# EAGLE schematic HeatingController (EAGLE 6.5.0)

## Sheet 1 of 2
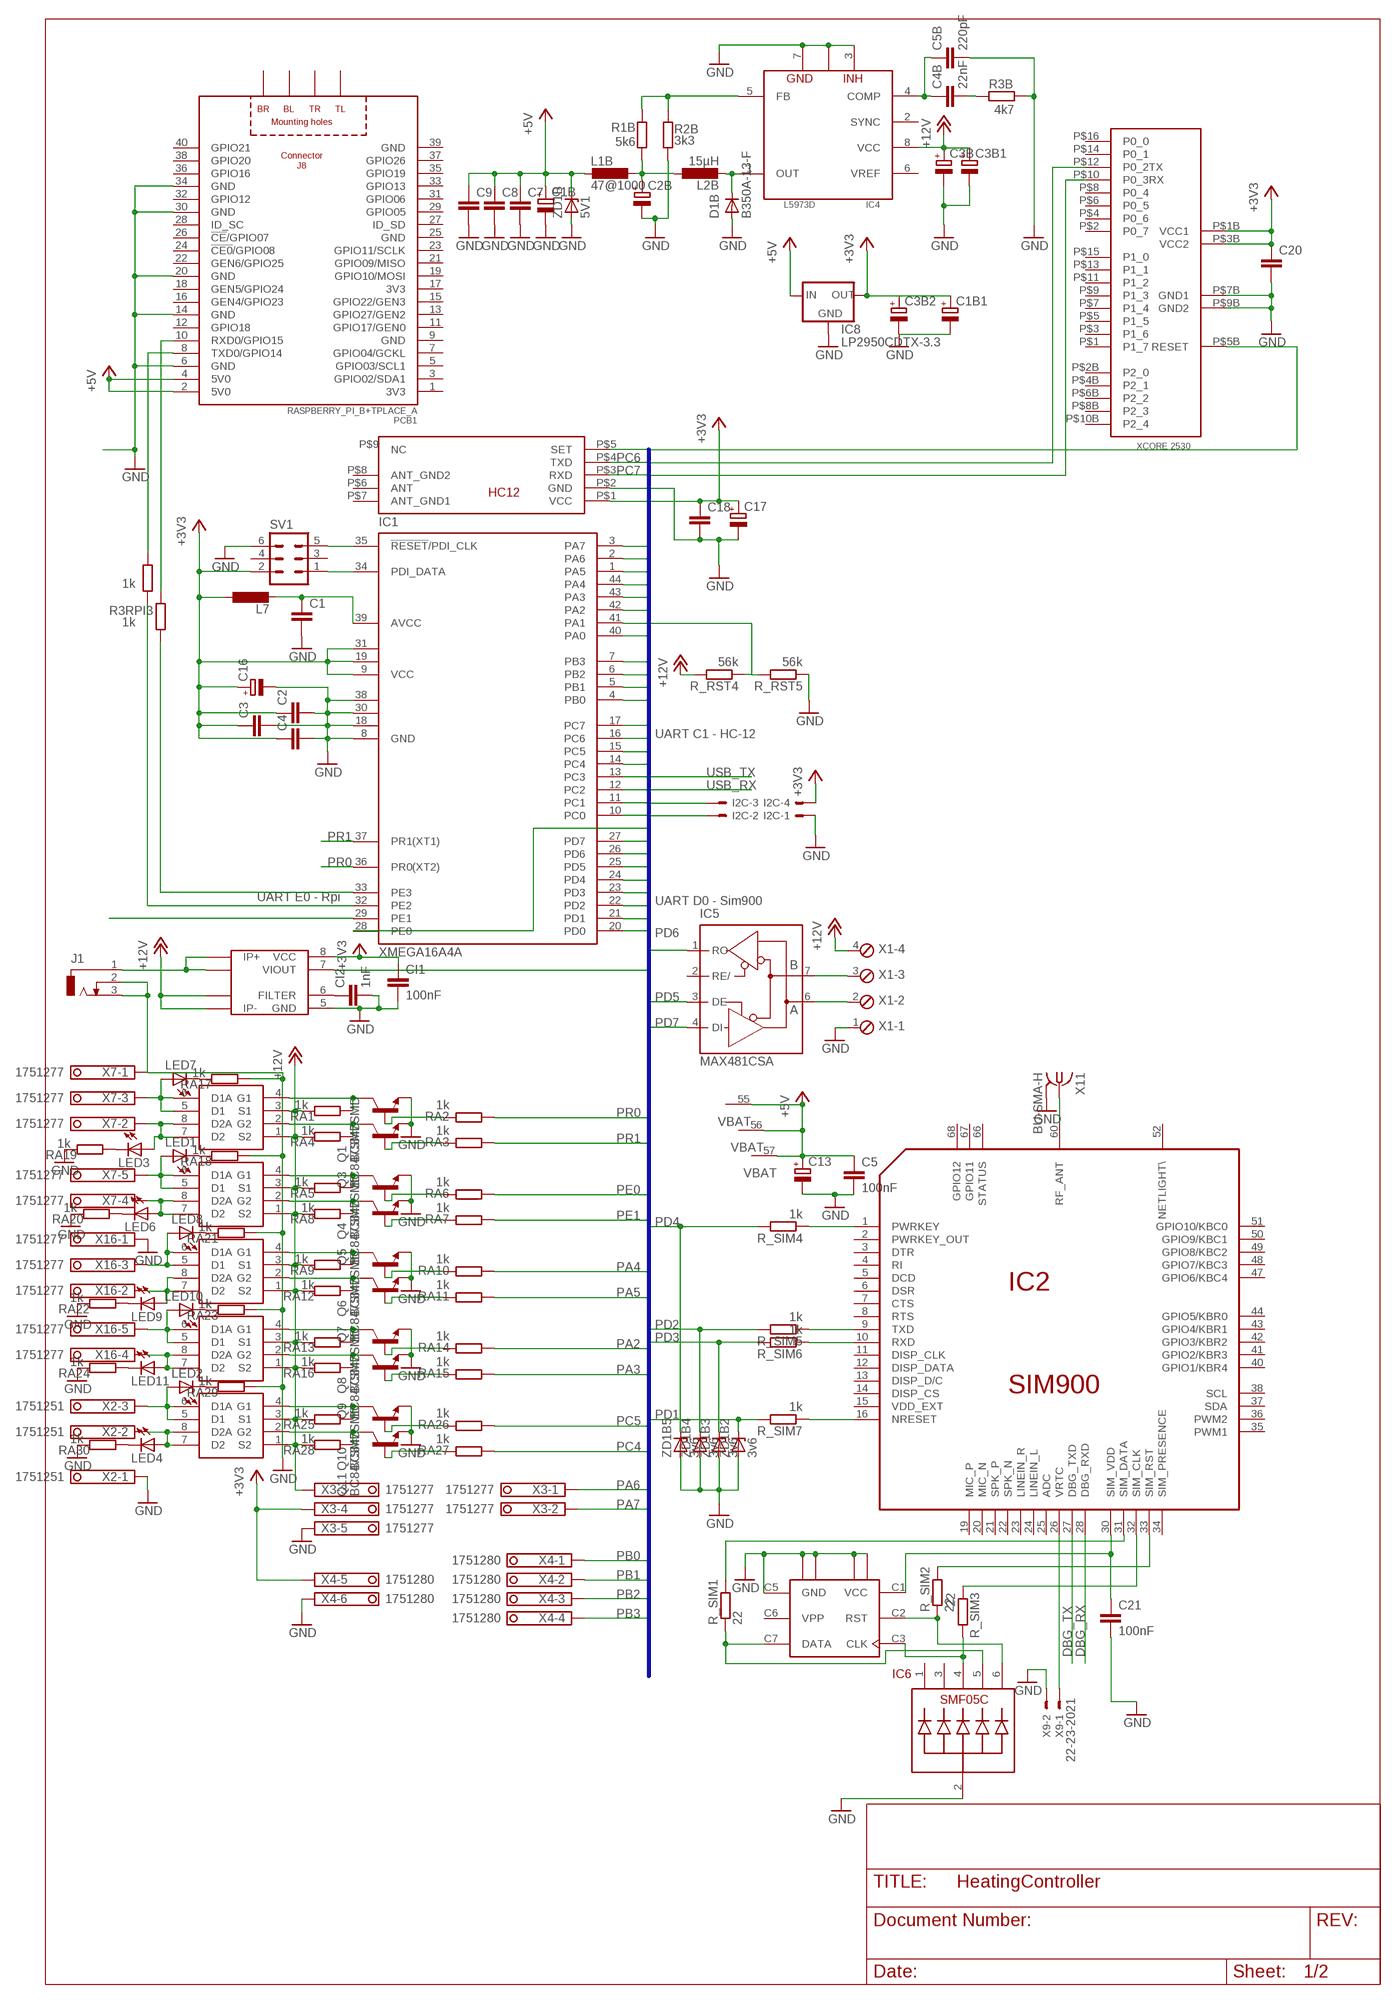
[diagram p0: schematic, sheet 1]

### Parts
C1  C-EUC0805  [C0805]
C1B  CPOL-EU153CLV-0405  [153CLV-0405]
C1B1  CPOL-EU140CLH-0810  [140CLH-0810]
C2  C-EUC0805  [C0805]
C2B  CPOL-EU153CLV-0405  [153CLV-0405]
C3  C-EUC0805  [C0805]
C3B  CPOL-EU153CLV-0405  [153CLV-0405]
C3B1  CPOL-EU153CLV-0605  [153CLV-0605]
C3B2  CPOL-EU150CLZ-0810  [150CLZ-0810]
C4  C-EUC0805  [C0805]
C4B  22nF  C-EUC0805  [C0805]
C5  100nF  C-EUC1206  [C1206]
C5B  220pF  C-EUC0805  [C0805]
C7  C-EUC1206K  [C1206K]
C8  C-EUC1206K  [C1206K]
C9  C-EUC1206K  [C1206K]
C13  CPOL-EU153CLV-0605  [153CLV-0605]
C16  CPOL-EU153CLV-0405  [153CLV-0405]
C17  CPOL-EU140CLH-0810  [140CLH-0810]
C18  C-EUC0805  [C0805]
C20  C-EUC0805  [C0805]
C21  100nF  C-EUC1206  [C1206]
CI1  100nF  C-EUC0805  [C0805]
CI2  1nF  C-EUC0805  [C0805]
D1B  B350A-13-F  GF1  [SMA-DO214AC]
I2C  22-23-2041  [22-23-2041]
IC1  XMEGA16A4A  [TQFP44]
IC2  SIM900  [SIM900]
IC4  L5973D  [HSOP8-PAD]
IC5  MAX481CSA  [SO08]
IC6  SMF05C  [SC-70-6]
IC8  LP2950CDTX-3.3  [DPACK]
J1  DCJ0303  [DCJ0303]
L1B  47@1000  L-EUL4532P  [L4532P]
L2B  15µH  L-EUWE-TPC  [POWER-CHOKE_WE-TPC]
L7  L-EUL4035M  [L4035M]
LED1  LEDCHIPLED_0805  [CHIPLED_0805]
LED2  LEDCHIPLED_0805  [CHIPLED_0805]
LED3  LEDCHIPLED_0805  [CHIPLED_0805]
LED4  LEDCHIPLED_0805  [CHIPLED_0805]
LED6  LEDCHIPLED_0805  [CHIPLED_0805]
LED7  LEDCHIPLED_0805  [CHIPLED_0805]
LED8  LEDCHIPLED_0805  [CHIPLED_0805]
LED9  LEDCHIPLED_0805  [CHIPLED_0805]
LED10  LEDCHIPLED_0805  [CHIPLED_0805]
LED11  LEDCHIPLED_0805  [CHIPLED_0805]
PCB1  RASPBERRY_PI_B+TPLACE_A  [RASPBERRY_PI_APLUS_TPLACE]
Q1  BC847SMD  [SOT23]
Q3  BC847SMD  [SOT23]
Q4  BC847SMD  [SOT23]
Q5  BC847SMD  [SOT23]
Q6  BC847SMD  [SOT23]
Q7  BC847SMD  [SOT23]
Q8  BC847SMD  [SOT23]
Q9  BC847SMD  [SOT23]
Q10  BC847SMD  [SOT23]
Q11  BC847SMD  [SOT23]
R1B  5k6  R-EU_R1206  [R1206]
R2B  3k3  R-EU_R1206  [R1206]
R3B  4k7  R-EU_R1206  [R1206]
R3RPI2  1k  R-EU_R1206  [R1206]
R3RPI3  1k  R-EU_R1206  [R1206]
R_RST4  56k  R-EU_R1206  [R1206]
R_RST5  56k  R-EU_R1206  [R1206]
R_SIM1  22  R-EU_R1206  [R1206]
R_SIM2  22  R-EU_R1206  [R1206]
R_SIM3  22  R-EU_R1206  [R1206]
R_SIM4  1k  R-EU_R1206  [R1206]
R_SIM5  1k  R-EU_R1206  [R1206]
R_SIM6  1k  R-EU_R1206  [R1206]
R_SIM7  1k  R-EU_R1206  [R1206]
RA1  1k  R-EU_R0805  [R0805]
RA2  1k  R-EU_R0805  [R0805]
RA3  1k  R-EU_R0805  [R0805]
RA4  1k  R-EU_R0805  [R0805]
RA5  1k  R-EU_R0805  [R0805]
RA6  1k  R-EU_R0805  [R0805]
RA7  1k  R-EU_R0805  [R0805]
RA8  1k  R-EU_R0805  [R0805]
RA9  1k  R-EU_R0805  [R0805]
RA10  1k  R-EU_R0805  [R0805]
RA11  1k  R-EU_R0805  [R0805]
RA12  1k  R-EU_R0805  [R0805]
RA13  1k  R-EU_R0805  [R0805]
RA14  1k  R-EU_R0805  [R0805]
RA15  1k  R-EU_R0805  [R0805]
RA16  1k  R-EU_R0805  [R0805]
RA17  1k  R-EU_R0805  [R0805]
RA18  1k  R-EU_R0805  [R0805]
RA19  1k  R-EU_R0805  [R0805]
RA20  1k  R-EU_R0805  [R0805]
RA21  1k  R-EU_R0805  [R0805]
RA22  1k  R-EU_R0805  [R0805]
RA23  1k  R-EU_R0805  [R0805]
RA24  1k  R-EU_R0805  [R0805]
RA25  1k  R-EU_R0805  [R0805]
RA26  1k  R-EU_R0805  [R0805]
RA27  1k  R-EU_R0805  [R0805]
RA28  1k  R-EU_R0805  [R0805]
RA29  1k  R-EU_R0805  [R0805]
RA30  1k  R-EU_R0805  [R0805]
SV1  ML6  [ML6]
U$1  AO4801A  [SO-08]
U$2  AO4801A  [SO-08]
U$3  HC-12  [HC-12]
U$4  XCORE2530  [XCORE2530]
U$7  SCU-W0822XR-06115R-BCA0  [115R-BCA0]
U$8  ACS712SO8  [SO-08M]
U$9  AO4801A  [SO-08]
U$10  AO4801A  [SO-08]
U$11  AO4801A  [SO-08]
X1  MPT4  [4POL254]
X2  1751251  [1751251]
X3  1751277  [1751277]
X4  1751280  [1751280]
X7  1751277  [1751277]
X9  22-23-2021  [22-23-2021]
X11  BU-SMA-H  [BU-SMA-H]
X16  1751277  [1751277]
ZD1B  5V1  BZV55-C5V1  [SOD80C]
ZD1B2  3v6  BZV55-C5V1  [SOD80C]
ZD1B3  3v6  BZV55-C5V1  [SOD80C]
ZD1B4  3v6  BZV55-C5V1  [SOD80C]
ZD1B5  3v6  BZV55-C5V1  [SOD80C]

### Nets
+3V3: C1B1.+ C2.1 C3.1 C3B2.+ C4.1 C16.+ C17.+ C18.1 C20.1 CI1.1 I2C.4 IC1.9(VCC) IC1.19(VCC1) IC1.31(VCC2) IC8.3(OUT) L7.1 SV1.2 U$3.P$1(VCC) U$4.P$1B(VCC1) U$4.P$3B(VCC2) U$8.8(VCC) X3.4 X4.5 ; also sheet 2
+5V: C1B.+ C5.1 C7.1 C8.1 C9.1 C13.+ IC2.55(VBAT) IC2.56(VBAT) IC2.57(VBAT) IC8.1(IN) L1B.2 PCB1.2(5V0) PCB1.4(5V0) ZD1B.C ; also sheet 2
+12V: C3B1.+ C3B.+ IC4.8(VCC) R_RST4.2 RA1.2 RA4.2 RA5.2 RA8.2 RA9.2 RA12.2 RA13.2 RA16.2 RA25.2 RA28.2 U$1.1(S2) U$1.3(S1) U$2.1(S2) U$2.3(S1) U$8.3(IP-3) U$8.4(IP-) U$9.1(S2) U$9.3(S1) U$10.1(S2) U$10.3(S1) U$11.1(S2) U$11.3(S1) X1.4 X3.3
AVCC: C1.1 IC1.39(AVCC) L7.2
COMP2: C4B.1 C5B.1 IC4.4(COMP)
CPU_RST: IC1.35(!RESET!/PDI_CLK) SV1.5
DBG_RX: IC2.28(DBG_RXD) ; also sheet 2
DBG_TX: IC2.27(DBG_TXD) ; also sheet 2
GND: C1.2 C1B1.- C1B.- C2.2 C2B.- C3.2 C3B1.- C3B2.- C3B.- C4.2 C5.2 C5B.2 C7.2 C8.2 C9.2 C13.- C16.- C17.- C18.2 C20.2 C21.2 CI1.2 CI2.2 D1B.A I2C.1 IC1.8(GND) IC1.18(GND1) IC1.30(GND2) IC1.38(GND3) IC4.3(INH) IC4.7(GND) IC4.P(GND) IC6.2 IC8.4(GND) J1.2 J1.3 PCB1.6(GND) PCB1.14(GND) PCB1.20(GND) PCB1.30(GND) PCB1.34(GND) Q1.2(E) Q3.2(E) Q4.2(E) Q5.2(E) Q6.2(E) Q7.2(E) Q8.2(E) Q9.2(E) Q10.2(E) Q11.2(E) R2B.1 R3B.1 R_RST5.1 RA17.1 RA18.1 RA19.2 RA20.2 RA21.1 RA22.2 RA23.1 RA24.2 RA29.1 RA30.2 SV1.6 U$3.P$2(GND) U$4.P$7B(GND1) U$4.P$9B(GND2) U$7.C5(GND) U$7.P$1(GND4) U$7.P$2(GND3) U$7.P$3(GND2) U$7.P$4(GND1) U$8.5(GND) X1.1 X2.1 X3.5 X4.6 X7.1 X9.2 X11.2 X11.3 X11.4 X11.5 X16.1 ZD1B2.A ZD1B3.A ZD1B4.A ZD1B5.A ZD1B.A ; also sheet 2
IC4_FB: IC4.5(FB) R1B.1 R2B.2
N$3: PCB1.8(TXD0/GPIO14) R3RPI2.2
N$4: LED4.A U$11.7(D2) U$11.8(D2A) X2.2
N$5: LED7.A U$1.5(D1) U$1.6(D1A) X7.3
N$6: LED3.A U$1.7(D2) U$1.8(D2A) X7.2
N$7: LED7.C RA17.2
N$8: LED1.A U$2.5(D1) U$2.6(D1A) X7.5
N$9: LED2.A U$11.5(D1) U$11.6(D1A) X2.3
N$10: Q10.3(C) RA25.1 U$11.4(G1)
N$11: CI2.1 U$8.6(FILTER)
N$12: LED6.A U$2.7(D2) U$2.8(D2A) X7.4
N$15: LED8.A U$9.5(D1) U$9.6(D1A) X16.3
N$18: LED9.A U$9.7(D2) U$9.8(D2A) X16.2
N$19: LED11.A U$10.7(D2) U$10.8(D2A) X16.4
N$20: D1B.K(C) IC4.1(OUT) L2B.2
N$22: C2B.+ L1B.1 L2B.1 R1B.2
N$23: LED10.A U$10.5(D1) U$10.6(D1A) X16.5
N$25: Q1.3(C) RA1.1 U$1.4(G1)
N$26: C4B.2 R3B.2
N$27: IC2.9(TXD) R_SIM5.1
N$29: Q4.3(C) RA5.1 U$2.4(G1)
N$30: Q1.1(B) RA2.2
N$31: Q3.1(B) RA3.2
N$32: IC2.26(VRTC) X9.1
N$33: Q3.3(C) RA4.1 U$1.2(G2)
N$34: IC2.10(RXD) R_SIM6.1
N$37: Q10.1(B) RA26.2
N$40: IC2.16(NRESET) R_SIM7.1
N$41: PCB1.10(RXD0/GPIO15) R3RPI3.2
N$42: IC2.60(RF_ANT) X11.1
N$43: Q4.1(B) RA6.2
N$44: Q5.1(B) RA7.2
N$45: Q5.3(C) RA8.1 U$2.2(G2)
N$46: Q6.3(C) RA9.1 U$9.4(G1)
N$47: Q6.1(B) RA10.2
N$48: Q7.1(B) RA11.2
N$49: Q7.3(C) RA12.1 U$9.2(G2)
N$50: Q8.3(C) RA13.1 U$10.4(G1)
N$51: Q8.1(B) RA14.2
N$52: Q9.1(B) RA15.2
N$53: Q9.3(C) RA16.1 U$10.2(G2)
N$54: LED1.C RA18.2
N$55: LED3.C RA19.1
N$56: LED6.C RA20.1
N$57: LED8.C RA21.2
N$58: LED9.C RA22.1
N$59: LED10.C RA23.2
N$60: LED11.C RA24.1
N$61: Q11.1(B) RA27.2
N$62: Q11.3(C) RA28.1 U$11.2(G2)
N$63: LED2.C RA29.2
N$64: LED4.C RA30.1
PA0: IC1.40(PA0) U$8.7(VIOUT)
PA1: IC1.41(PA1) R_RST4.1 R_RST5.2
PA2: IC1.42(PA2) RA14.1
PA3: IC1.43(PA3) RA15.1
PA4: IC1.44(PA4) RA10.1
PA5: IC1.1(PA5) RA11.1
PA6: IC1.2(PA6) X3.1
PA7: IC1.3(PA7) X3.2
PB0: IC1.4(PB0) X4.1
PB1: IC1.5(PB1) X4.2
PB2: IC1.6(PB2) X4.3
PB3: IC1.7(PB3) X4.4
PC0: I2C.2 IC1.10(PC0)
PC1: I2C.3 IC1.11(PC1)
PC4: IC1.14(PC4) RA27.1
PC5: IC1.15(PC5) RA26.1
PC6: IC1.16(PC6) U$3.P$4(TXD) U$4.P$12(P0_2TX)
PC7: IC1.17(PC7) U$3.P$3(RXD) U$4.P$10(P0_3RX)
PD0: IC1.20(PD0) U$3.P$5(SET) U$4.P$5B(RESET)
PD1: IC1.21(PD1) R_SIM7.2 ZD1B2.C
PD2: IC1.22(PD2) R_SIM5.2 ZD1B4.C
PD3: IC1.23(PD3) R_SIM6.2 ZD1B3.C
PD4: IC1.24(PD4) R_SIM4.2 ZD1B5.C
PD5: IC1.25(PD5) IC5.3(DE)
PD6: IC1.26(PD6) IC5.1(RO)
PD7: IC1.27(PD7) IC5.4(DI)
PDI_DTA: IC1.34(PDI_DATA) SV1.1
PE0: IC1.28(PE0) RA6.1
PE1: IC1.29(PE1) RA7.1
PE2: IC1.32(PE2) R3RPI2.1
PE3: IC1.33(PE3) R3RPI3.1
PR0: IC1.36(PR0(XT2)) RA2.1
PR1: IC1.37(PR1(XT1)) RA3.1
PWR: J1.1 U$8.1(IP+) U$8.2(IP+2)
RS_485_A: IC5.6(A) X1.2
RS_485_B: IC5.7(B) X1.3
SIM900PWRKEY: IC2.1(PWRKEY) R_SIM4.1
SIM_CLK: IC2.32(SIM_CLK) R_SIM3.1
SIM_DTA: IC2.31(SIM_DATA) R_SIM1.2
SIM_DTA_S: IC6.5 R_SIM1.1 U$7.C7(DATA)
SIM_RST: IC2.33(SIM_RST) R_SIM2.2
SIM_VCC: C21.1 IC2.30(SIM_VDD) U$7.C1(VCC)
SIMCLS_S: IC6.4 R_SIM3.2 U$7.C3(CLK)
SIMRSTS: IC6.6 R_SIM2.1 U$7.C2(RST)
USB_RX: IC1.12(PC2) ; also sheet 2
USB_TX: IC1.13(PC3) ; also sheet 2
Unconnected: IC2.2(PWRKEY_OUT) IC2.3(DTR) IC2.4(RI) IC2.5(DCD) IC2.6(DSR) IC2.7(CTS) IC2.8(RTS) IC2.11(DISP_CLK) IC2.12(DISP_DATA) IC2.13(DISP_D/C) IC2.14(DISP_CS) IC2.15(VDD_EXT) IC2.19(MIC_P) IC2.20(MIC_N) IC2.21(SPK_P) IC2.22(SPK_N) IC2.23(LINEIN_R) IC2.24(LINEIN_L) IC2.25(ADC) IC2.34(SIM_PRESENCE) IC2.35(PWM1) IC2.36(PWM2) IC2.37(SDA) IC2.38(SCL) IC2.40(GPIO1/KBR4) IC2.41(GPIO2/KBR3) IC2.42(GPIO3/KBR2) IC2.43(GPIO4/KBR1) IC2.44(GPIO5/KBR0) IC2.47(GPIO6/KBC4) IC2.48(GPIO7/KBC3) IC2.49(GPIO8/KBC2) IC2.50(GPIO9/KBC1) IC2.51(GPIO10/KBC0) IC2.52(NETLIGHT\) IC2.66(STATUS) IC2.67(GPIO11) IC2.68(GPIO12) IC4.2(SYNC) IC4.6(VREF) IC5.2(RE/) IC6.1 IC6.3 PCB1.3(GPIO02/SDA1) PCB1.5(GPIO03/SCL1) PCB1.7(GPIO04/GCKL) PCB1.11(GPIO17/GEN0) PCB1.12(GPIO18) PCB1.13(GPIO27/GEN2) PCB1.15(GPIO22/GEN3) PCB1.16(GEN4/GPIO23) PCB1.18(GEN5/GPIO24) PCB1.19(GPIO10/MOSI) PCB1.21(GPIO09/MISO) PCB1.22(GEN6/GPIO25) PCB1.23(GPIO11/SCLK) PCB1.24(!CE0!/GPIO08) PCB1.26(!CE!/GPIO07) PCB1.27(ID_SD) PCB1.28(ID_SC) PCB1.29(GPIO05) PCB1.31(GPIO06) PCB1.32(GPIO12) PCB1.33(GPIO13) PCB1.35(GPIO19) PCB1.36(GPIO16) PCB1.37(GPIO26) PCB1.38(GPIO20) PCB1.40(GPIO21) PCB1.PE_BL(BL) PCB1.PE_BR(BR) PCB1.PE_TL(TL) PCB1.PE_TR(TR) SV1.3 SV1.4 U$3.P$6(ANT) U$3.P$7(ANT_GND1) U$3.P$8(ANT_GND2) U$3.P$9(NC) U$4.P$1(P1_7) U$4.P$2(P0_7) U$4.P$2B(P2_0) U$4.P$3(P1_6) U$4.P$4(P0_6) U$4.P$4B(P2_1) U$4.P$5(P1_5) U$4.P$6(P0_5) U$4.P$6B(P2_2) U$4.P$7(P1_4) U$4.P$8(P0_4) U$4.P$8B(P2_3) U$4.P$9(P1_3) U$4.P$10B(P2_4) U$4.P$11(P1_2) U$4.P$13(P1_1) U$4.P$14(P0_1) U$4.P$15(P1_0) U$4.P$16(P0_0)

### Buses
PA[0..7],PB[0..3],PC[0..7],PD[0..7],PE[0..1],PR[0..1]

### Notes on the sheet
- UART C1 - HC-12
- UART E0 - Rpi
- UART D0 - Sim900

## Sheet 2 of 2
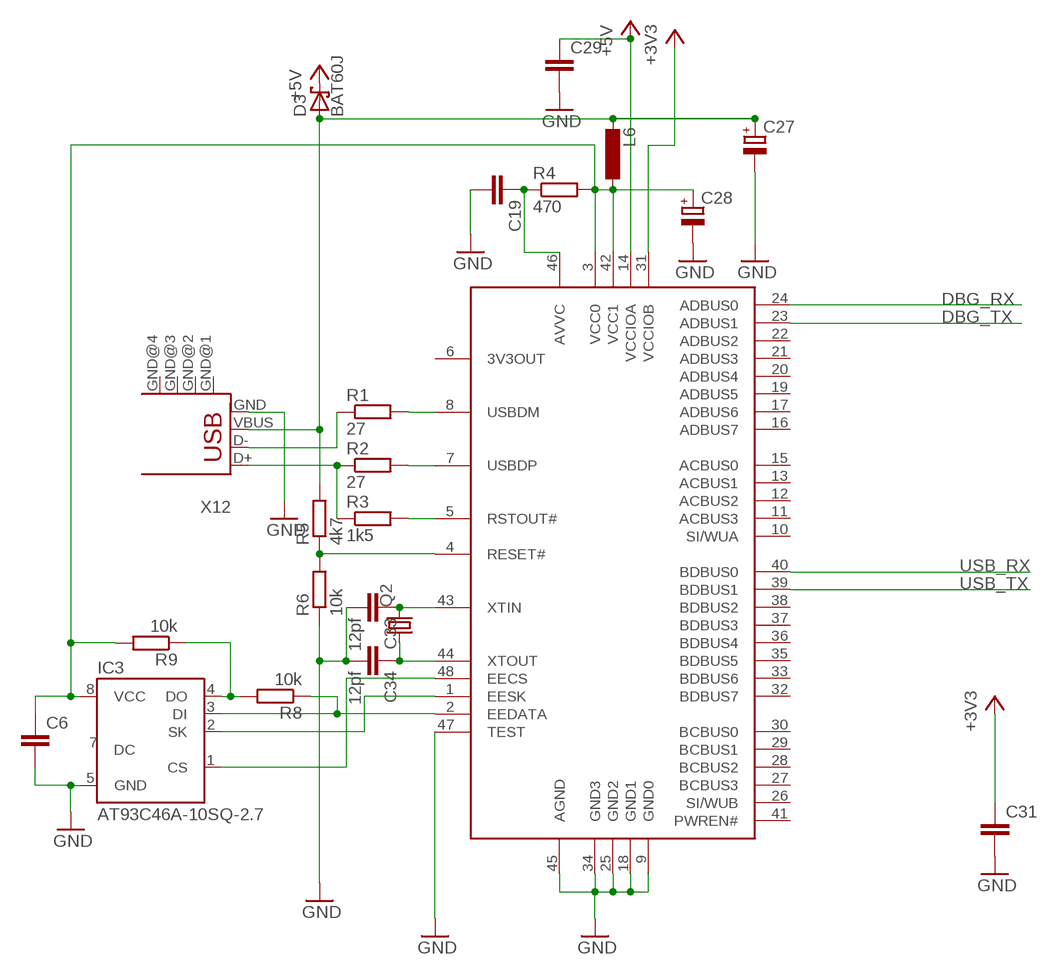
[diagram p1: schematic, sheet 2]

### Parts
C6  C-EUC0805K  [C0805K]
C19  C-EUC0805  [C0805]
C27  CPOL-EU153CLV-0405  [153CLV-0405]
C28  CPOL-EU153CLV-0405  [153CLV-0405]
C29  C-EUC1206  [C1206]
C31  C-EUC1206  [C1206]
C33  12pf  C-EUC0805  [C0805]
C34  12pf  C-EUC0805  [C0805]
D3  BAT60J  [SOD323_ST]
IC3  AT93C46A-10SQ-2.7  [SOIC8]
IC7  FT2232C  [LQFP]
L6  L-EUL2012C  [L2012C]
Q2  CRYSTALHC49S  [HC49/S]
R1  27  R-EU_M1206  [M1206]
R2  27  R-EU_M1206  [M1206]
R3  1k5  R-EU_M1206  [M1206]
R4  470  R-EU_M0805  [M0805]
R5  4k7  R-EU_M1206  [M1206]
R6  10k  R-EU_M1206  [M1206]
R8  10k  R-EU_M1206  [M1206]
R9  10k  R-EU_M1206  [M1206]
X12  USB-SHIELD  [USB-M-S1]

### Nets
+3V3: C31.1 IC7.31(VCCIOB) ; also sheet 1
+5V: C29.1 D3.C IC7.14(VCCIOA) ; also sheet 1
DBG_RX: IC7.24(ADBUS0) ; also sheet 1
DBG_TX: IC7.23(ADBUS1) ; also sheet 1
FD_DI: IC3.3(DI) IC7.2(EEDATA) R8.1
FT_AVCC: C19.1 IC7.46(AVVC) R4.1
FT_CS: IC3.1(CS) IC7.48(EECS)
FT_DO: IC3.4(DO) R8.2 R9.1
FT_SK: IC3.2(SK) IC7.1(EESK)
FT_VCC: C6.1 C28.+ IC3.8(VCC) IC7.3(VCC0) IC7.42(VCC1) L6.1 R4.2 R9.2
GND: C6.2 C19.2 C27.- C28.- C29.2 C31.2 C33.2 C34.2 IC3.5(GND) IC7.9(GND0) IC7.18(GND1) IC7.25(GND2) IC7.34(GND3) IC7.45(AGND) IC7.47(TEST) R6.1 X12.GND ; also sheet 1
N$13: IC7.8(USBDM) R1.2
N$14: IC7.7(USBDP) R2.2
N$16: R2.1 R3.1 X12.D+
N$17: R1.1 X12.D-
N$21: IC7.5(RSTOUT#) R3.2
N$36: C33.1 IC7.43(XTIN) Q2.2
N$38: C34.1 IC7.44(XTOUT) Q2.1
N$39: IC7.4(RESET#) R5.1 R6.2
USB_RX: IC7.40(BDBUS0) ; also sheet 1
USB_TX: IC7.39(BDBUS1) ; also sheet 1
V_USB: C27.+ D3.A L6.2 R5.2 X12.VBUS
Unconnected: IC3.6(NC) IC3.7(DC) IC7.6(3V3OUT) IC7.10(SI/WUA) IC7.11(ACBUS3) IC7.12(ACBUS2) IC7.13(ACBUS1) IC7.15(ACBUS0) IC7.16(ADBUS7) IC7.17(ADBUS6) IC7.19(ADBUS5) IC7.20(ADBUS4) IC7.21(ADBUS3) IC7.22(ADBUS2) IC7.26(SI/WUB) IC7.27(BCBUS3) IC7.28(BCBUS2) IC7.29(BCBUS1) IC7.30(BCBUS0) IC7.32(BDBUS7) IC7.33(BDBUS6) IC7.35(BDBUS5) IC7.36(BDBUS4) IC7.37(BDBUS3) IC7.38(BDBUS2) IC7.41(PWREN#) X12.GND@1(GND) X12.GND@2(GND) X12.GND@3(GND) X12.GND@4(GND)

## Power pins joined to a net without a drawn wire
3V3: PCB1.1(3V3) PCB1.17(3V3)
+3V3: IC5.8(VCC)
GND: IC2.17(GND) IC2.18(GND) IC2.29(GND) IC2.39(GND) IC2.45(GND) IC2.46(GND) IC2.53(GND) IC2.54(GND) IC2.58(GND) IC2.59(GND) IC2.61(GND) IC2.62(GND) IC2.63(GND) IC2.64(GND) IC2.65(GND) IC5.5(GND) PCB1.9(GND) PCB1.25(GND) PCB1.39(GND)
VPP: U$7.C6(VPP)

## Library data of the parts
C1-C4 C4B C5 C5B C6-C9 C18-C21 C29 C31 C33 C34 CI1 CI2 = rcl:C-EU: CAPACITOR, European symbol
C1B C1B1 C2B C3B C3B1 C3B2 C13 C16 C17 C27 C28 = rcl:CPOL-EU: POLARIZED CAPACITOR, European symbol
D1B = diode:GF1: DIODE
D3 = diode:BAT60J: Schottky barrier diode Source: www.st.com, BAT60J.pdf
I2C = con-molex:22-23-2041: .100" (2.54mm) Center Header - 4 Pin; MF: MOLEX; MPN: 22-23-2041; OC_FARNELL: 1462920; OC_NEWARK: 38C0355
IC1 = atmel:XMEGA16A4: MICROCONTROLLER Features High-performance, Low-power 8/16-bit AVR XMEGA Microcontroller Non-Volatile Program and Data Memories - 16 KB - 128 KB of In-System Self-Programmable Flash - 4 KB - 8 KB Boot Code Section with Independent Lock Bits - 1 KB - 2 KB EEPROM - 2 KB - 8 KB Internal SRAM Peripheral Features - Four-channel DMA Controller with support for external requests - Eight-channel Event System - Five 16-bit Timer/Counters Three Timer/Counters with 4 Output Compare or Input Capture channels Two Timer/Counters with 2 Output Compare or Input Capture channels High-Resolution Extensions on all Timer/Counters Advanced Waveform Extension on one Timer/Counter - Five USARTs IrDA Extension on one USART - Two Two-Wire Interfaces with dual address match (I2C and SMBus compatible) - Two SPIs (Serial Peripheral Interfaces) peripherals - AES and DES Crypto Engine - 16-bit Real Time Counter with Separate Oscillator - One Twelve-channel, 12-bit, 2 Msps Analog to Digital Converter - One Two-channel, 12-bit, 1 Msps Digital to Analog Converter - Two Analog Comparators with Window compare function - External Interrupts on all General Purpose I/O pins - Programmable Watchdog Timer with Separate On-chip Ultra Low Power Oscillator Special Microcontroller Features - Power-on Reset and Programmable Brown-out Detection - Internal and External Clock Options with PLL - Programmable Multi-level Interrupt Controller - Sleep Modes: Idle, Power-down, Standby, Power-save, Extended Standby - Advanced Programming, Test and Debugging Interfaces PDI (Program and Debug Interface) for programming, test and debugging I/O and Packages - 34 Programmable I/O Lines - 44 - lead TQFP - 44 - pad VQFN/QFN - 49 - ball VFBGA Operating Voltage - 1.6 - 3.6V Speed performance - 0 - 12 MHz @ 1.6 - 3.6V - 0 - 32 MHz @ 2.7 - 3.6V Drawn by Dipl.-Ing. (FH) Robert Siegler Created: 27.05.09; OC_FARNELL: unknown; OC_NEWARK: unknown
IC2 = sim900:SIM900
IC3 = atmel:AT93C46A-10?Q-2.7: Three-wire Automotive Temperature Serial EEPROM 1K (64 x 16) Source: http://www.atmel.com/dyn/resources/prod_documents/doc5089.pdf; MPN: AT93C46DN-SH-B; OC_FARNELL: 1455086; OC_NEWARK: 58M3879
IC4 = vreg-pulse:L5973: 2A SWITCH STEP DOWN SWITCHING REGULATOR
IC5 = maxim:MAX481CSA: RS485 TRANSEIVER; MF: MAXIM; MPN: MAX481CSA; OC_FARNELL: unknown; OC_NEWARK: 90C3817
IC6 = smf05c:SMF05C
IC7 = ft2232c:FT2232C
IC8 = v-reg:LP2950?*: Source: http://cache.national.com/ds/LP/LP2950.pdf
J1 = con-jack:DCJ0303: DC POWER JACK Source: DCJ0303.pdf; OC_FARNELL: unknown; OC_NEWARK: unknown
L1B L2B L6 L7 = rcl:L-EU: INDUCTOR, European symbol
LED1-LED4 LED6-LED11 = led:LED: LED OSRAM: - CHIPLED LG R971, LG N971, LY N971, LG Q971, LY Q971, LO R971, LY R971 LH N974, LH R974 LS Q976, LO Q976, LY Q976 LO Q996 - Hyper CHIPLED LW Q18S LB Q993, LB Q99A, LB R99A - SideLED LS A670, LO A670, LY A670, LG A670, LP A670 LB A673, LV A673, LT A673, LW A673 LH A674 LY A675 LS A676, LA A676, LO A676, LY A676, LW A676 LS A679, LY A679, LG A679 - Hyper Micro SIDELED® LS Y876, LA Y876, LO Y876, LY Y876 LT Y87S - SmartLED LW L88C, LW L88S LB L89C, LB L89S, LG L890 LS L89K, LO L89K, LY L89K LS L896, LA L896, LO L896, LY L896 - TOPLED LS T670, LO T670, LY T670, LG T670, LP T670 LSG T670, LSP T670, LSY T670, LOP T670, LYG T670 LG T671, LOG T671, LSG T671 LB T673, LV T673, LT T673, LW T673 LH T674 LS T676, LA T676, LO T676, LY T676, LB T676, LH T676, LSB T676, LW T676 LB T67C, LV T67C, LT T67C, LS T67K, LO T67K, LY T67K, LW E67C LS E67B, LA E67B, LO E67B, LY E67B, LB E67C, LV E67C, LT E67C LW T67C LS T679, LY T679, LG T679 LS T770, LO T770, LY T770, LG T770, LP T770 LB T773, LV T773, LT T773, LW T773 LH T774 LS E675, LA E675, LY E675, LS T675 LS T776, LA T776, LO T776, LY T776, LB T776 LHGB T686 LT T68C, LB T68C - Hyper Mini TOPLED® LB M676 - Mini TOPLED Santana® LG M470 LS M47K, LO M47K, LY M47K Source: http://www.osram.convergy.de - LUMILED® LXK2-PW12-R00, LXK2-PW12-S00, LXK2-PW14-U00, LXK2-PW14-V00 LXK2-PM12-R00, LXK2-PM12-S00, LXK2-PM14-U00 LXK2-PE12-Q00, LXK2-PE12-R00, LXK2-PE12-S00, LXK2-PE14-T00, LXK2-PE14-U00 LXK2-PB12-K00, LXK2-PB12-L00, LXK2-PB12-M00, LXK2-PB14-N00, LXK2-PB14-P00, LXK2-PB14-Q00 LXK2-PR12-L00, LXK2-PR12-M00, LXK2-PR14-Q00, LXK2-PR14-R00 LXK2-PD12-Q00, LXK2-PD12-R00, LXK2-PD12-S00 LXK2-PH12-R00, LXK2-PH12-S00 LXK2-PL12-P00, LXK2-PL12-Q00, LXK2-PL12-R00 Source: www.luxeon.com
PCB1 = raspberry:RASPBERRY_PI_B+: Raspberry Pi B+ Basedon issue: Thursday, July 10, 2014 - Rev 1.2 LBR by Tim Rettmann 07-2014
Q1 Q3-Q11 = transistor-npn:BC847*: NPN Transistor
Q2 = crystal:CRYSTAL: CRYSTAL; OC_FARNELL: 1667008; OC_NEWARK: unknown
R1 R1B R2 R2B R3 R3B R3RPI2 R3RPI3 R4-R6 R8 R9 R_RST4 R_RST5 R_SIM1-R_SIM7 RA1-RA30 = rcl:R-EU_: RESISTOR, European symbol
SV1 = con-ml:ML6: HARTING; OC_FARNELL: unknown; OC_NEWARK: unknown
U$1 U$2 U$9-U$11 = moje:AO4801A
U$3 = sim900:HC-12: HC-12 Wireless Serial Port Communication Module
U$4 = RobotElementy:XCORE2530
U$7 = con-sim:SCU-W0822XR-06
U$8 = current:ACS712
X1 = con-phoenix-254:MPT4: PHOENIX CONNECTOR; OC_FARNELL: unknown; OC_NEWARK: unknown
X2 = con-phoenix-350:1751251: MKDS 1/ 3-3,5 Printklemme Nennstrom: 10 A Bemessungsspannung: 160 V Raster: 3,5 mm Polzahl: 3 Montageart: Löten Anschlussart: Schraubanschluss Anschlussrichtung vom Leiter zur Platine: 0° Source: http://eshop.phoenixcontact.com .. 1751251.pdf; OC_FARNELL: unknown; OC_NEWARK: unknown
X3 X7 X16 = con-phoenix-350:1751277: MKDS 1/ 5-3,5 Printklemme Nennstrom: 10 A Bemessungsspannung: 160 V Raster: 3,5 mm Polzahl: 5 Montageart: Löten Anschlussart: Schraubanschluss Anschlussrichtung vom Leiter zur Platine: 0° Source: http://eshop.phoenixcontact.com .. 1751277.pdf; OC_FARNELL: unknown; OC_NEWARK: unknown
X4 = con-phoenix-350:1751280: MKDS 1/ 6-3,5 Printklemme Nennstrom: 10 A Bemessungsspannung: 160 V Raster: 3,5 mm Polzahl: 6 Montageart: Löten Anschlussart: Schraubanschluss Anschlussrichtung vom Leiter zur Platine: 0° Source: http://eshop.phoenixcontact.com .. 1751280.pdf; MPN: 1751280; OC_FARNELL: unknown; OC_NEWARK: 27R1765
X9 = con-molex:22-23-2021: .100" (2.54mm) Center Header - 2 Pin; MF: MOLEX; MPN: 22-23-2021; OC_FARNELL: 1462926; OC_NEWARK: 25C3832
X11 = con-coax:BU-SMA-H: FEMALE SMA CONNECTOR Radiall; OC_FARNELL: unknown; OC_NEWARK: unknown
X12 = usb:USB-SHIELD
ZD1B ZD1B2-ZD1B5 = diodes:BZV55-C5V1